# EAGLE design RHD2132_headstage1 (EAGLE 6.2)
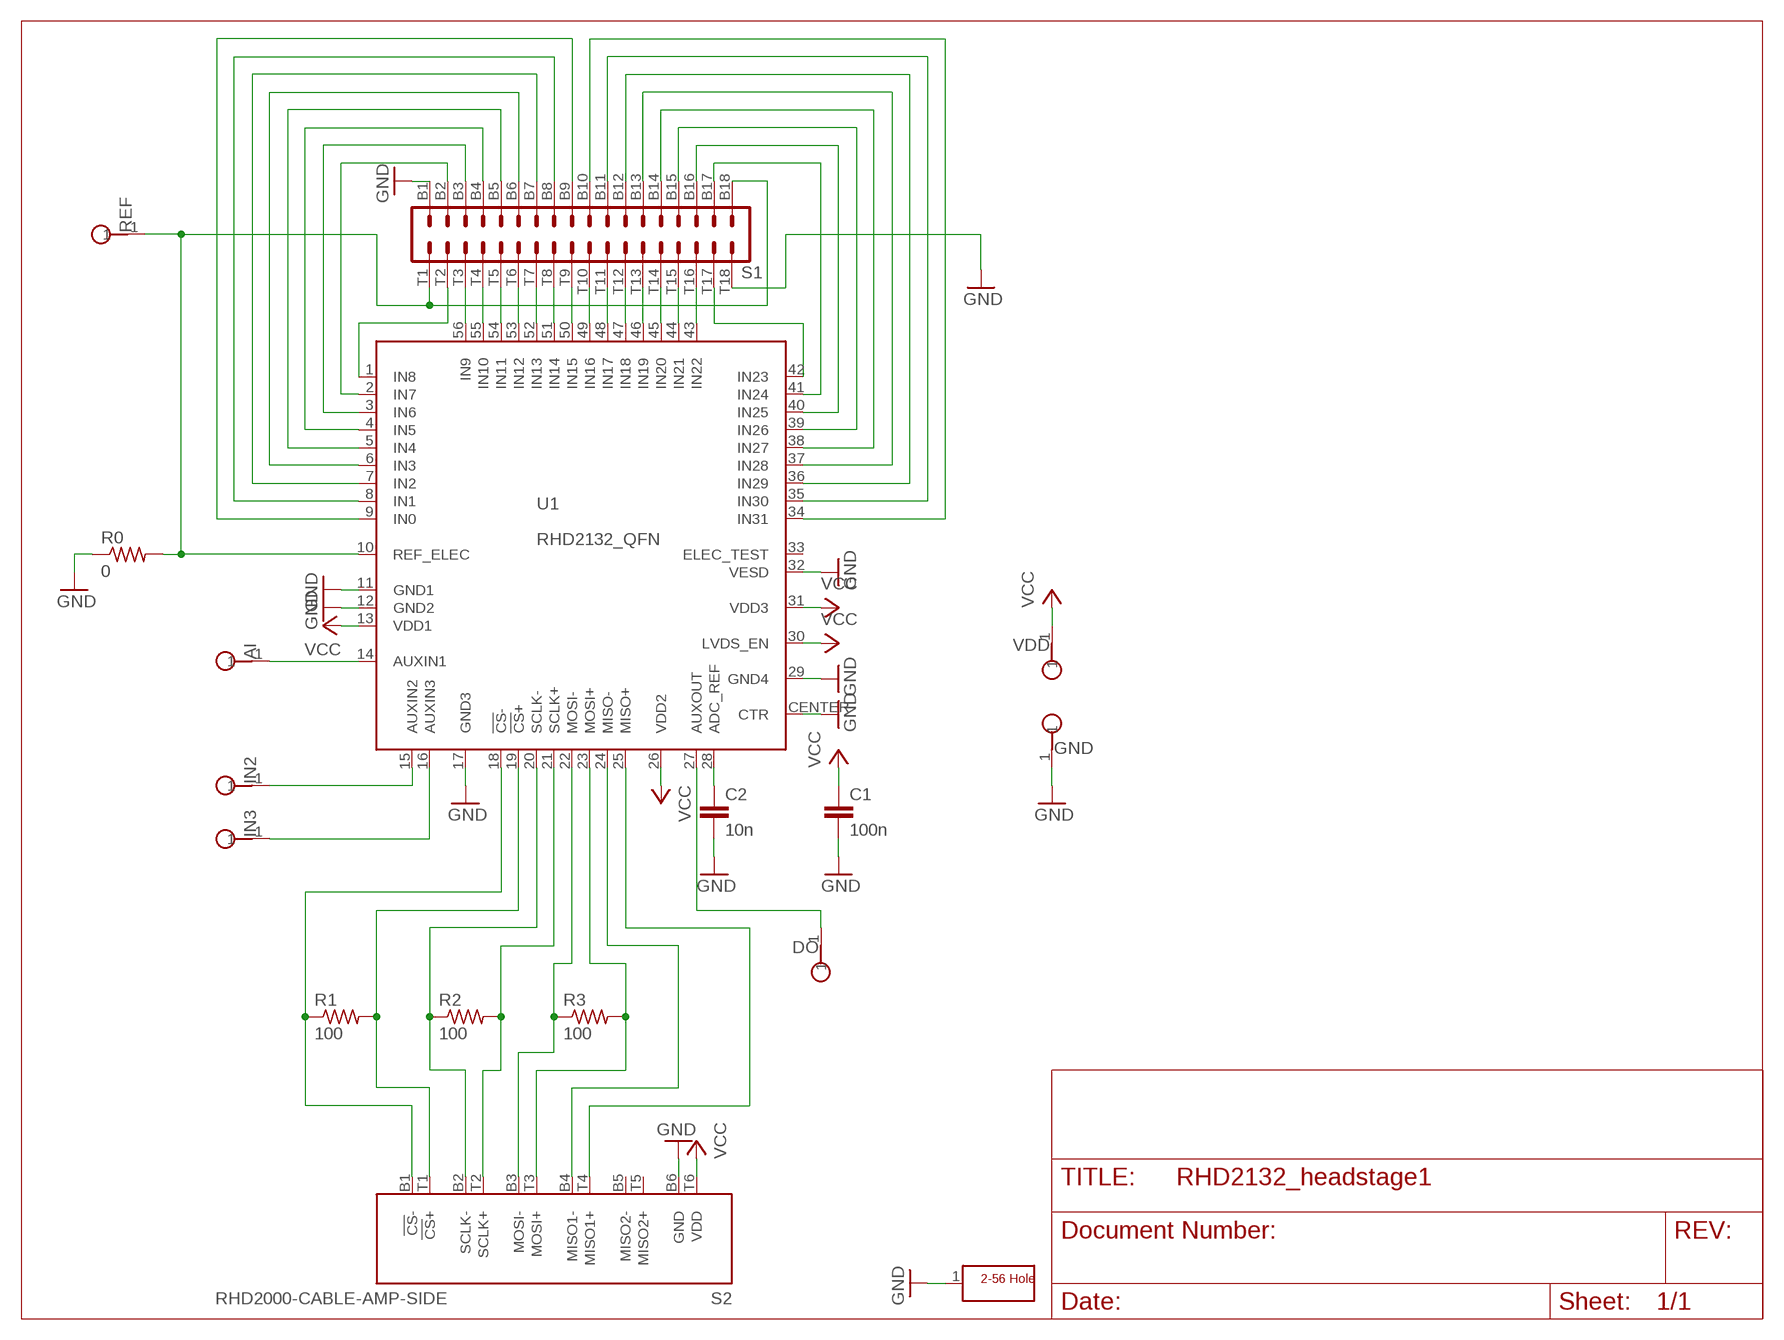
[diagram p0: schematic, sheet 1]

## Parts
AI  TESTPOINT_SMALL  [TESTPOINT_SMALL]
C1  100n  C_0402  [0402]
C2  10n  C_0402  [0402]
DO  TESTPOINT_SMALL  [TESTPOINT_SMALL]
GND  TESTPOINT_SMALL  [TESTPOINT_SMALL]
H1  SCREW_HOLE_2-56  [SCREW_HOLE_2-56]
IN2  TESTPOINT_SMALL  [TESTPOINT_SMALL]
IN3  TESTPOINT_SMALL  [TESTPOINT_SMALL]
R0  0  R_0402  [0402]
R1  100  R_0402  [0402]
R2  100  R_0402  [0402]
R3  100  R_0402  [0402]
REF  TESTPOINT_SMALL  [TESTPOINT_SMALL]
S1  OMNETICS_A79025  [OMNETICS_A79025]
S2  RHD2000-CABLE-AMP-SIDE  [OMNETICS_PZN-12-AA]
U1  RHD2132_QFN  [QFN56_8_X_8_LARGE]
VDD  TESTPOINT_SMALL  [TESTPOINT_SMALL]

## Nets
GND: C1.2 C2.2 GND.1 H1.1 R0.1 S1.B1 S1.T18 S2.B6(GND) U1.11(GND1) U1.12(GND2) U1.17(GND3) U1.29(GND4) U1.32(VESD) U1.CENTER(CTR)
N$1: R0.2 REF.1 S1.B18 S1.T1 U1.10(REF_ELEC)
N$2: S1.B3 U1.3(IN6)
N$3: S1.B2 U1.2(IN7)
N$4: S1.B4 U1.4(IN5)
N$5: S1.B5 U1.5(IN4)
N$6: S1.B6 U1.6(IN3)
N$7: S1.B7 U1.7(IN2)
N$8: S1.B8 U1.8(IN1)
N$9: S1.B9 U1.9(IN0)
N$10: S1.B10 U1.34(IN31)
N$11: R1.1 S2.B1(!CS!-) U1.18(!CS!-)
N$12: S1.B17 U1.41(IN24)
N$13: S1.B16 U1.40(IN25)
N$14: S1.B15 U1.39(IN26)
N$15: S1.B14 U1.38(IN27)
N$16: S1.B13 U1.37(IN28)
N$17: S1.B12 U1.36(IN29)
N$18: S1.B11 U1.35(IN30)
N$19: S1.T9 U1.50(IN15)
N$20: S1.T8 U1.51(IN14)
N$21: S1.T7 U1.52(IN13)
N$22: S1.T3 U1.56(IN9)
N$23: S1.T4 U1.55(IN10)
N$24: S1.T5 U1.54(IN11)
N$25: S1.T6 U1.53(IN12)
N$26: S1.T10 U1.49(IN16)
N$27: S1.T11 U1.48(IN17)
N$28: S1.T12 U1.47(IN18)
N$29: S1.T13 U1.46(IN19)
N$30: S1.T14 U1.45(IN20)
N$31: S1.T15 U1.44(IN21)
N$32: S1.T16 U1.43(IN22)
N$33: S1.T2 U1.1(IN8)
N$34: S1.T17 U1.42(IN23)
N$35: R1.2 S2.T1(!CS!+) U1.19(!CS!+)
N$36: R2.1 S2.B2(SCLK-) U1.20(SCLK-)
N$37: R2.2 S2.T2(SCLK+) U1.21(SCLK+)
N$38: R3.1 S2.B3(MOSI-) U1.22(MOSI-)
N$39: R3.2 S2.T3(MOSI+) U1.23(MOSI+)
N$40: S2.B4(MISO1-) U1.24(MISO-)
N$41: S2.T4(MISO1+) U1.25(MISO+)
N$42: C2.1 U1.28(ADC_REF)
N$43: DO.1 U1.27(AUXOUT)
N$44: AI.1 U1.14(AUXIN1)
N$46: IN2.1 U1.15(AUXIN2)
N$48: IN3.1 U1.16(AUXIN3)
VCC: C1.1 S2.T6(VDD) U1.13(VDD1) U1.26(VDD2) U1.30(LVDS_EN) U1.31(VDD3) VDD.1
Unconnected: S2.B5(MISO2-) S2.T5(MISO2+) U1.33(ELEC_TEST)

## Library data of the parts
AI DO GND IN2 IN3 REF VDD = RHD2000_eval_board:TESTPOINT: PCB Test Point
C1 C2 = RHD2000_eval_board:C: Capacitor
H1 = RHD2000_eval_board:SCREW_HOLE_2-56: Mounting hole
R0 R1-R3 = RHD2000_eval_board:R: Resistor
S1 = RHD2000:OMNETICS_A79025
S2 = RHD2000:RHD2000-CABLE-AMP-SIDE
U1 = RHD2000:RHD2132

## Net classes
1 thick: width 1.016 mm
2 power: width 0.61 mm

## Board
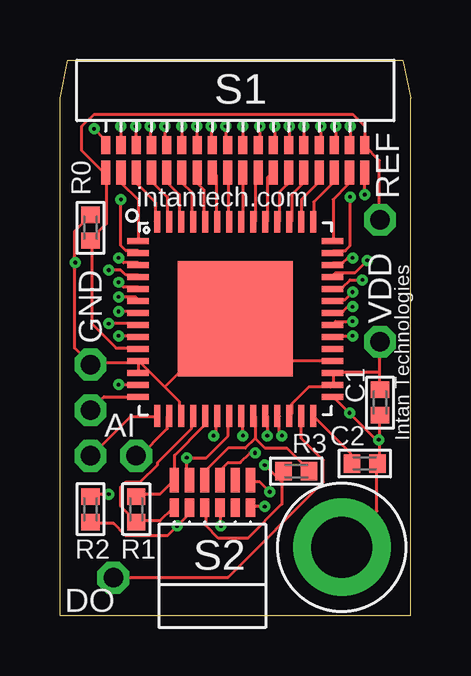
[diagram p1: board, top side]
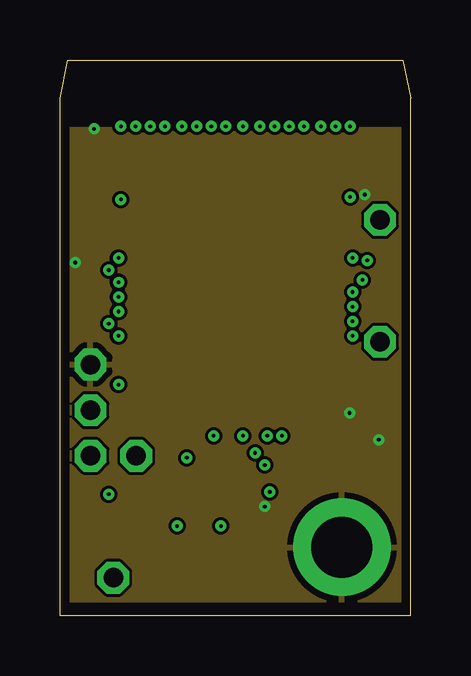
[diagram p2: board, inner layer Route2]
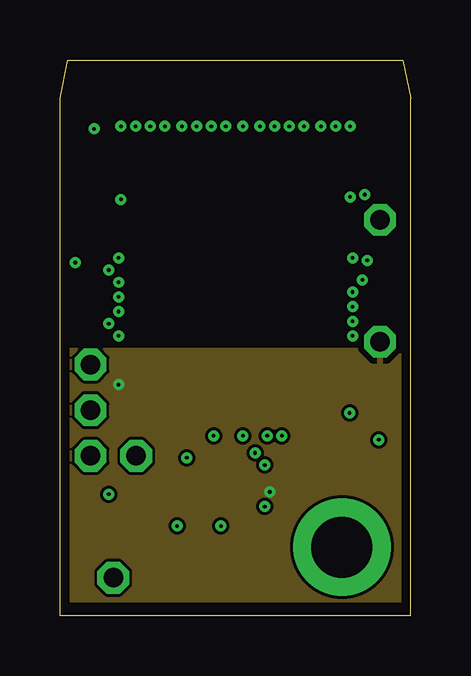
[diagram p3: board, inner layer Route3]
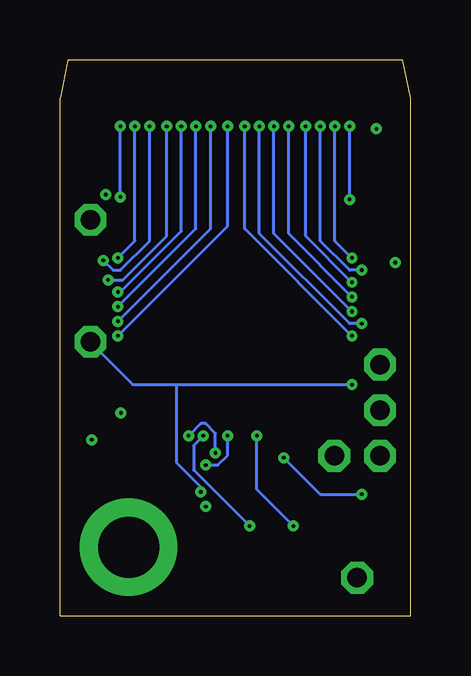
[diagram p4: board, bottom side, seen from below]

Size 14.61 x 23.18 mm. Coordinates in mm from the lower left corner, seen from the top.
Outline: 0,0 0,21.59 0.32,23.18 14.29,23.18 14.61,21.59 14.61,0 0,0
Copper layers (1*2+3*16): Top 0.035mm / dielectric 1.5mm / Route2 0.035mm / dielectric 0.15mm / Route3 0.035mm / dielectric 0.2mm / Bottom 0.035mm
Design rules: minimum track width 5mil, minimum drill 6mil, track to track 5mil, track to pad 5mil, pad to pad 5mil, via to via 5mil, smd to smd 5mil, copper to edge 15mil, drill to drill 15mil, minimum pad ring 10mil, minimum via ring 6mil, stop-mask expansion 4mil, vias tented up to drill 0mil, thermal gap 10mil

### Footprints (pad centres in the part's own frame; a part is rotated, then mirrored left to right if it is on the bottom)
TESTPOINT_SMALL = drill 0.813 octagon: 1 0,0
0402 = smd 0.686 x 0.762: 1 -0.533,0; 2 0.533,0
SCREW_HOLE_2-56 = drill 2.54 pad 4.064: 1 0,0
OMNETICS_A79025 = smd 0.381 x 0.762: B1 -5.397,-1.016; B2 -4.763,-1.016; B3 -4.128,-1.016; B4 -3.493,-1.016; B5 -2.857,-1.016; B6 -2.223,-1.016; B7 -1.587,-1.016; B8 -0.953,-1.016; B9 -0.318,-1.016; B10 0.318,-1.016; B11 0.953,-1.016; B12 1.587,-1.016; B13 2.223,-1.016; B14 2.857,-1.016; B15 3.493,-1.016; B16 4.128,-1.016; B17 4.763,-1.016; B18 5.397,-1.016 | smd 0.381 x 1.016: T1 -5.397,-2.159; T2 -4.763,-2.159; T3 -4.128,-2.159; T4 -3.493,-2.159; T5 -2.857,-2.159; T6 -2.223,-2.159; T7 -1.587,-2.159; T8 -0.953,-2.159; T9 -0.318,-2.159; T10 0.318,-2.159; T11 0.953,-2.159; T12 1.587,-2.159; T13 2.223,-2.159; T14 2.857,-2.159; T15 3.493,-2.159; T16 4.128,-2.159; T17 4.763,-2.159; T18 5.397,-2.159
OMNETICS_PZN-12-AA = smd 0.381 x 0.762: B1 1.587,-1.016; B2 0.953,-1.016; B3 0.318,-1.016; B4 -0.318,-1.016; B5 -0.953,-1.016; B6 -1.587,-1.016 | smd 0.381 x 1.016: T1 1.587,-2.159; T2 0.953,-2.159; T3 0.318,-2.159; T4 -0.318,-2.159; T5 -0.953,-2.159; T6 -1.587,-2.159
QFN56_8_X_8_LARGE = smd 0.9 x 0.25: 1 -4.05,3.25; 2 -4.05,2.75; 3 -4.05,2.25; 4 -4.05,1.75; 5 -4.05,1.25; 6 -4.05,0.75; 7 -4.05,0.25; 8 -4.05,-0.25; 9 -4.05,-0.75; 10 -4.05,-1.25; 11 -4.05,-1.75; 12 -4.05,-2.25; 13 -4.05,-2.75; 14 -4.05,-3.25; 29 4.05,-3.25; 30 4.05,-2.75; 31 4.05,-2.25; 32 4.05,-1.75; 33 4.05,-1.25; 34 4.05,-0.75; 35 4.05,-0.25; 36 4.05,0.25; 37 4.05,0.75; 38 4.05,1.25; 39 4.05,1.75; 40 4.05,2.25; 41 4.05,2.75; 42 4.05,3.25 | smd 0.25 x 0.9: 15 -3.25,-4.05; 16 -2.75,-4.05; 17 -2.25,-4.05; 18 -1.75,-4.05; 19 -1.25,-4.05; 20 -0.75,-4.05; 21 -0.25,-4.05; 22 0.25,-4.05; 23 0.75,-4.05; 24 1.25,-4.05; 25 1.75,-4.05; 26 2.25,-4.05; 27 2.75,-4.05; 28 3.25,-4.05; 43 3.25,4.05; 44 2.75,4.05; 45 2.25,4.05; 46 1.75,4.05; 47 1.25,4.05; 48 0.75,4.05; 49 0.25,4.05; 50 -0.25,4.05; 51 -0.75,4.05; 52 -1.25,4.05; 53 -1.75,4.05; 54 -2.25,4.05; 55 -2.75,4.05; 56 -3.25,4.05 | smd 4.8 x 4.8: CENTER 0,0

### Placement (x,y rotation side)
AI  1.27,8.57 90 top
C1  13.34,8.89 270 top
C2  12.7,6.35 0 top
DO  2.22,1.59 0 top
GND  1.27,10.48 0 top
H1  11.75,2.86 0 top
IN2  1.27,6.67 90 top
IN3  3.17,6.67 0 top
R0  1.27,16.18 270 top
R1  3.17,4.45 90 top
R2  1.27,4.45 90 top
R3  9.84,6.03 0 top
REF  13.34,16.51 90 top
S1  7.3,20.64 0 top
S2  6.35,3.49 180 top
U1  7.3,12.38 0 top
VDD  13.34,11.43 0 top

### Tracks (layer width: path | path; a pad name or v marks a point on that pad's centre or on a via)
GND  (via drill 0.15)
  Top 0.127: U1.32 11.28,10.65 9.04,10.65 7.32,12.38 U1.CENTER 7.21,12.38 4.37,9.54 | 13.31,7.2 13.31,8.32 C1.2 | 13.31,7.2 13.31,6.39 C2.2 13.21,6.29 13.21,4.36 11.79,2.93 H1.1 | 13.31,7.2 11.38,9.13 U1.29 | 3.25,10.55 3.25,10.15 U1.12 | 4.37,9.54 3.35,10.55 U1.11 3.25,10.55 | 4.37,9.54 4.98,8.93 4.98,8.42 U1.17 | 7.92,4.56 S2.B6 8.03,4.56 v8.53,4.56 | R0.1 1.22,16.65 0.61,16.04 0.61,11.16 1.22,10.55 GND.1 1.32,10.55 3.25,10.55 | v1.42,20.31 1.83,19.9 1.83,19.7 S1.B1 | v12.7,17.56 S1.T18
  other vias: 12.06,8.46 13.28,7.34 0.64,14.73
  pour Route2: 0.32,0.64 14.29,0.64 14.29,20.32 0.32,20.32
N$1
  Top 0.127: REF.1 13.31,16.55 13.31,18.99 12.7,19.6 S1.B18 12.7,20.41 12.19,20.92 1.42,20.92 0.91,20.41 0.91,19.39 1.83,18.48 S1.T1 1.93,18.48 1.93,16.34 1.32,15.73 R0.2 1.32,15.63 1.32,12.18 2.34,11.16 3.25,11.16 U1.10
N$2  (via drill 0.15)
  Top 0.127: v3.15,20.41 3.15,19.7 S1.B3 | v2.44,14.92 2.64,14.72 3.25,14.72 U1.3
  Bottom 0.127: v3.15,20.41 3.15,15.63 v2.44,14.92
N$3  (via drill 0.15)
  Top 0.127: v2.54,20.41 S1.B2 | v2.54,17.36 2.54,15.43 2.74,15.23 3.25,15.23 U1.2
  Bottom 0.127: v2.54,17.36 v2.54,20.41
N$4  (via drill 0.15)
  Top 0.127: v3.76,20.41 3.76,19.7 S1.B4 | v2.03,14.41 2.54,14.41 2.74,14.21 3.25,14.21 U1.4
  Bottom 0.127: v3.76,20.41 3.76,15.63 2.54,14.41 v2.03,14.41
N$5  (via drill 0.15)
  Top 0.127: v4.37,20.41 4.37,19.7 S1.B5 | v2.44,13.91 2.64,13.7 3.25,13.7 U1.5
  Bottom 0.127: v4.37,20.41 4.37,15.84 v2.44,13.91
N$6  (via drill 0.15)
  Top 0.127: v5.08,20.41 S1.B6 | v2.44,13.3 3.15,13.3 3.25,13.2 U1.6
  Bottom 0.127: v5.08,20.41 5.08,15.94 v2.44,13.3
N$7  (via drill 0.15)
  Top 0.127: v5.69,20.41 5.69,19.7 S1.B7 | v2.44,12.69 3.25,12.69 U1.7
  Bottom 0.127: v5.69,20.41 5.69,15.94 v2.44,12.69
N$8  (via drill 0.15)
  Top 0.127: v6.3,20.41 6.3,19.7 S1.B8 | v2.03,12.18 3.25,12.18 U1.8
  Bottom 0.127: v6.3,20.41 6.3,15.94 2.54,12.18 v2.03,12.18
N$9  (via drill 0.15)
  Top 0.127: v6.91,20.41 6.91,19.7 S1.B9 | v2.44,11.67 3.25,11.67 U1.9
  Bottom 0.127: v6.91,20.41 6.91,16.14 v2.44,11.67
N$10  (via drill 0.15)
  Top 0.127: v7.62,20.41 S1.B10 | v12.19,11.67 11.38,11.67 U1.34
  Bottom 0.127: v7.62,20.41 7.62,16.24 v12.19,11.67
N$11
  Top 0.127: S2.B1 4.67,4.46 4.17,3.95 3.25,3.95 R1.1 3.15,3.95 2.54,4.56 2.54,5.37 2.74,5.58 3.35,5.58 4.06,6.29 4.06,6.39 5.49,7.81 5.49,8.32 U1.18
N$12  (via drill 0.15)
  Top 0.127: v12.09,20.41 12.09,19.7 S1.B17 | v12.09,17.46 12.09,15.43 11.89,15.23 11.38,15.23 U1.41
  Bottom 0.127: v12.09,17.46 v12.09,20.41
N$13  (via drill 0.15)
  Top 0.127: v11.48,20.41 11.48,19.7 S1.B16 | v12.19,14.92 11.99,14.92 11.79,14.72 11.38,14.72 U1.40
  Bottom 0.127: v11.48,20.41 11.48,15.63 v12.19,14.92
N$14  (via drill 0.15)
  Top 0.127: v10.87,20.41 10.87,19.7 S1.B15 | v12.8,14.82 12.29,14.31 11.48,14.31 11.38,14.21 U1.39
  Bottom 0.127: v10.87,20.41 10.87,15.63 12.09,14.41 12.39,14.41 v12.8,14.82
N$15  (via drill 0.15)
  Top 0.127: v10.16,20.41 S1.B14 | v12.6,14.01 12.09,14.01 11.79,13.7 11.38,13.7 U1.38
  Bottom 0.127: v10.16,20.41 10.16,15.84 11.99,14.01 v12.6,14.01
N$16  (via drill 0.15)
  Top 0.127: v9.55,20.41 9.55,19.7 S1.B13 | v12.19,13.5 11.89,13.2 11.38,13.2 U1.37
  Bottom 0.127: v9.55,20.41 9.55,16.04 12.09,13.5 v12.19,13.5
N$17  (via drill 0.15)
  Top 0.127: v8.94,20.41 8.94,19.7 S1.B12 | v12.19,12.89 11.99,12.89 11.79,12.69 11.38,12.69 U1.36
  Bottom 0.127: v8.94,20.41 8.94,16.14 v12.19,12.89
N$18  (via drill 0.15)
  Top 0.127: v8.33,20.41 8.33,19.7 S1.B11 | v12.19,12.28 11.48,12.28 11.38,12.18 U1.35
  Bottom 0.127: v8.33,20.41 8.33,16.14 v12.19,12.28
N$19
  Top 0.127: U1.50 7.01,16.45 7.01,18.48 S1.T9
N$20
  Top 0.127: U1.51 6.5,16.45 6.5,18.38 6.4,18.48 S1.T8
N$21
  Top 0.127: U1.52 5.99,16.45 5.99,17.77 5.79,17.97 5.79,18.48 S1.T7
N$22
  Top 0.127: U1.56 3.96,16.45 3.96,17.26 3.25,17.97 3.25,18.48 S1.T3
N$23
  Top 0.127: U1.55 4.47,16.45 4.47,17.46 3.86,18.07 3.86,18.48 S1.T4
N$24
  Top 0.127: U1.54 4.98,16.45 4.98,17.56 4.47,18.07 4.47,18.48 S1.T5
N$25
  Top 0.127: S1.T6 5.08,18.07 5.49,17.67 5.49,16.45 U1.53
N$26
  Top 0.127: S1.T10 7.62,16.45 U1.49
N$27
  Top 0.127: U1.48 8.13,16.45 8.13,18.38 8.23,18.48 S1.T11
N$28
  Top 0.127: U1.47 8.64,16.45 8.64,18.27 8.84,18.48 S1.T12
N$29
  Top 0.127: U1.46 9.14,16.45 9.14,17.67 9.45,17.97 9.45,18.48 S1.T13
N$30
  Top 0.127: S1.T14 10.16,18.07 9.65,17.56 9.65,16.45 U1.45
N$31
  Top 0.127: U1.44 10.06,16.45 10.06,17.36 10.77,18.07 10.77,18.48 S1.T15
N$32
  Top 0.127: U1.43 10.57,16.45 10.57,17.26 11.38,18.07 11.38,18.48 S1.T16
N$33
  Top 0.127: S1.T2 2.54,18.07 3.25,17.36 U1.1
N$34
  Top 0.127: U1.42 11.38,15.63 11.38,17.36 11.99,17.97 11.99,18.48 S1.T17
N$35
  Top 0.127: R1.2 3.25,5.07 4.17,5.07 4.67,5.58 S2.T1 4.78,5.68 4.78,6.69 5.99,7.91 5.99,8.32 U1.19
N$36  (via drill 0.15)
  Top 0.127: R2.1 1.32,3.85 2.23,3.85 2.74,3.34 4.47,3.34 v4.88,3.75 5.38,4.25 5.38,4.46 S2.B2 | v6.4,7.51 6.5,7.61 6.5,8.32 U1.20
  Bottom 0.127: v6.4,7.51 6.4,5.27 v4.88,3.75
N$37  (via drill 0.15)
  Top 0.127: v2.03,5.07 1.32,5.07 R2.2 | S2.T2 5.38,5.68 5.28,5.78 v5.28,6.59 6.1,6.59 7.01,7.51 7.01,8.32 U1.21
  Bottom 0.127: v2.03,5.07 3.76,5.07 v5.28,6.59
N$38  (via drill 0.15)
  Top 0.127: 9.25,5.58 9.25,5.98 R3.1 | 9.25,5.58 9.25,4.66 7.82,3.24 6.6,3.24 6.1,3.75 6.1,4.46 S2.B3 | v7.62,7.51 7.62,8.32 U1.22 | 9.25,5.58 v8.53,6.29
  Bottom 0.127: v7.62,7.51 7.62,6.69 8.03,6.29 v8.53,6.29
N$39
  Top 0.127: 8.13,7.4 8.53,7 9.45,7 10.36,6.08 R3.2 | 8.13,7.4 8.13,8.32 U1.23 | 8.13,7.4 7.72,7 7.01,7 6.1,6.08 6.1,5.68 S2.T3
N$40  (via drill 0.15)
  Top 0.127: v6.71,3.75 6.71,4.46 S2.B4 | v8.64,7.51 8.64,8.32 U1.24
  Bottom 0.127: v6.71,3.75 9.04,6.08 9.04,7.1 v8.64,7.51
N$41  (via drill 0.15)
  Top 0.127: v9.25,7.51 9.14,7.61 9.14,8.32 U1.25 | v8.13,6.79 7.92,6.79 7.52,6.39 7.01,6.39 6.71,6.08 6.71,5.68 S2.T4
  Bottom 0.127: v9.25,7.51 8.74,8.01 8.53,8.01 8.13,7.61 v8.13,6.79
N$42
  Top 0.127: C2.1 12.09,6.39 12.09,6.79 10.57,8.32 U1.28
N$43
  Top 0.127: U1.27 10.06,7.4 10.97,6.49 10.97,5.58 7.01,1.61 2.23,1.61 DO.1
N$44
  Top 0.127: AI.1 1.83,9.13 U1.14
N$46
  Top 0.127: U1.15 3.96,8.32 2.95,8.32 1.32,6.69 IN2.1
N$48
  Top 0.127: U1.16 4.47,8.32 4.47,7.81 3.25,6.59 IN3.1
VCC  (via drill 0.15)
  Top 0.127: U1.26 9.65,8.42 9.65,8.83 10.36,9.54 11.28,9.54 U1.30 11.38,9.64 11.38,10.05 U1.31 11.38,10.15 13.31,10.15 | 13.31,10.15 13.31,11.37 VDD.1 | 13.31,10.15 13.31,9.44 C1.1 | v2.44,9.64 U1.13 | v8.74,5.17 8.33,5.58 8.03,5.58 S2.T6
  Bottom 0.127: 9.75,9.64 11.58,9.64 13.31,11.37 VDD.1 | 9.75,9.64 v2.44,9.64 | v8.74,5.17 8.74,5.37 9.75,6.39 9.75,9.64
  pour Route3: 0.32,0.64 14.29,0.64 14.29,11.11 0.32,11.11

### Text on the board
tPlace: intantech.com | Intan Technologies